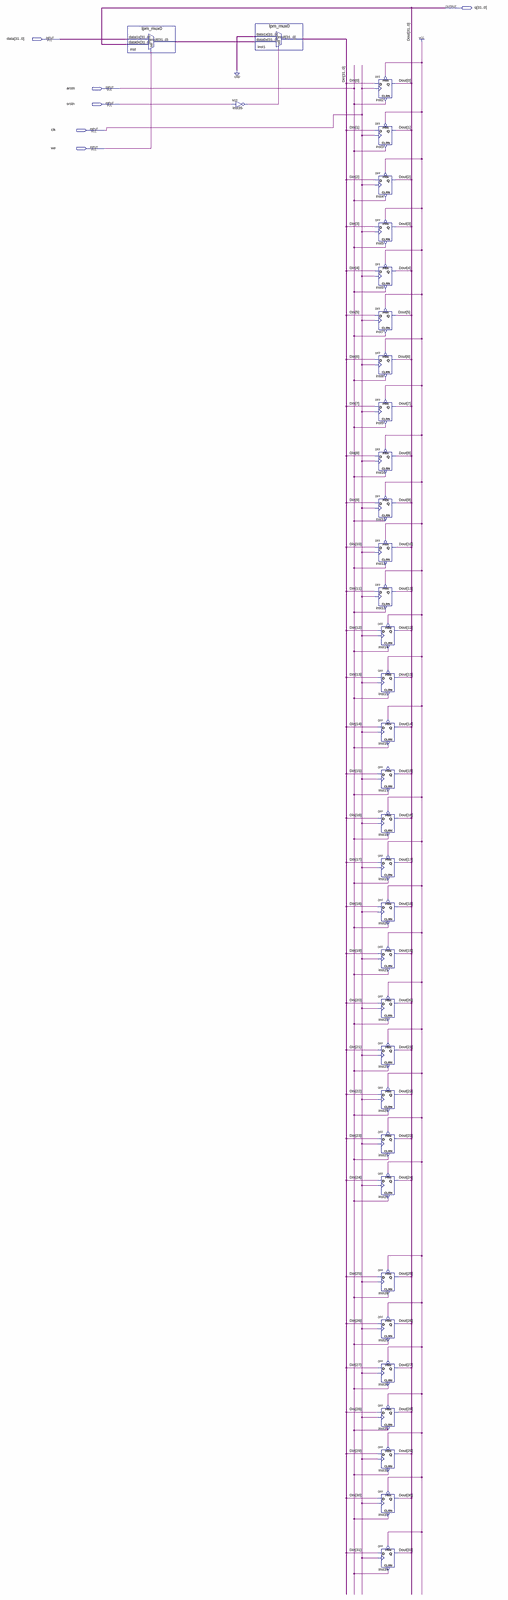
[diagram p0: schematic sheet, whole]
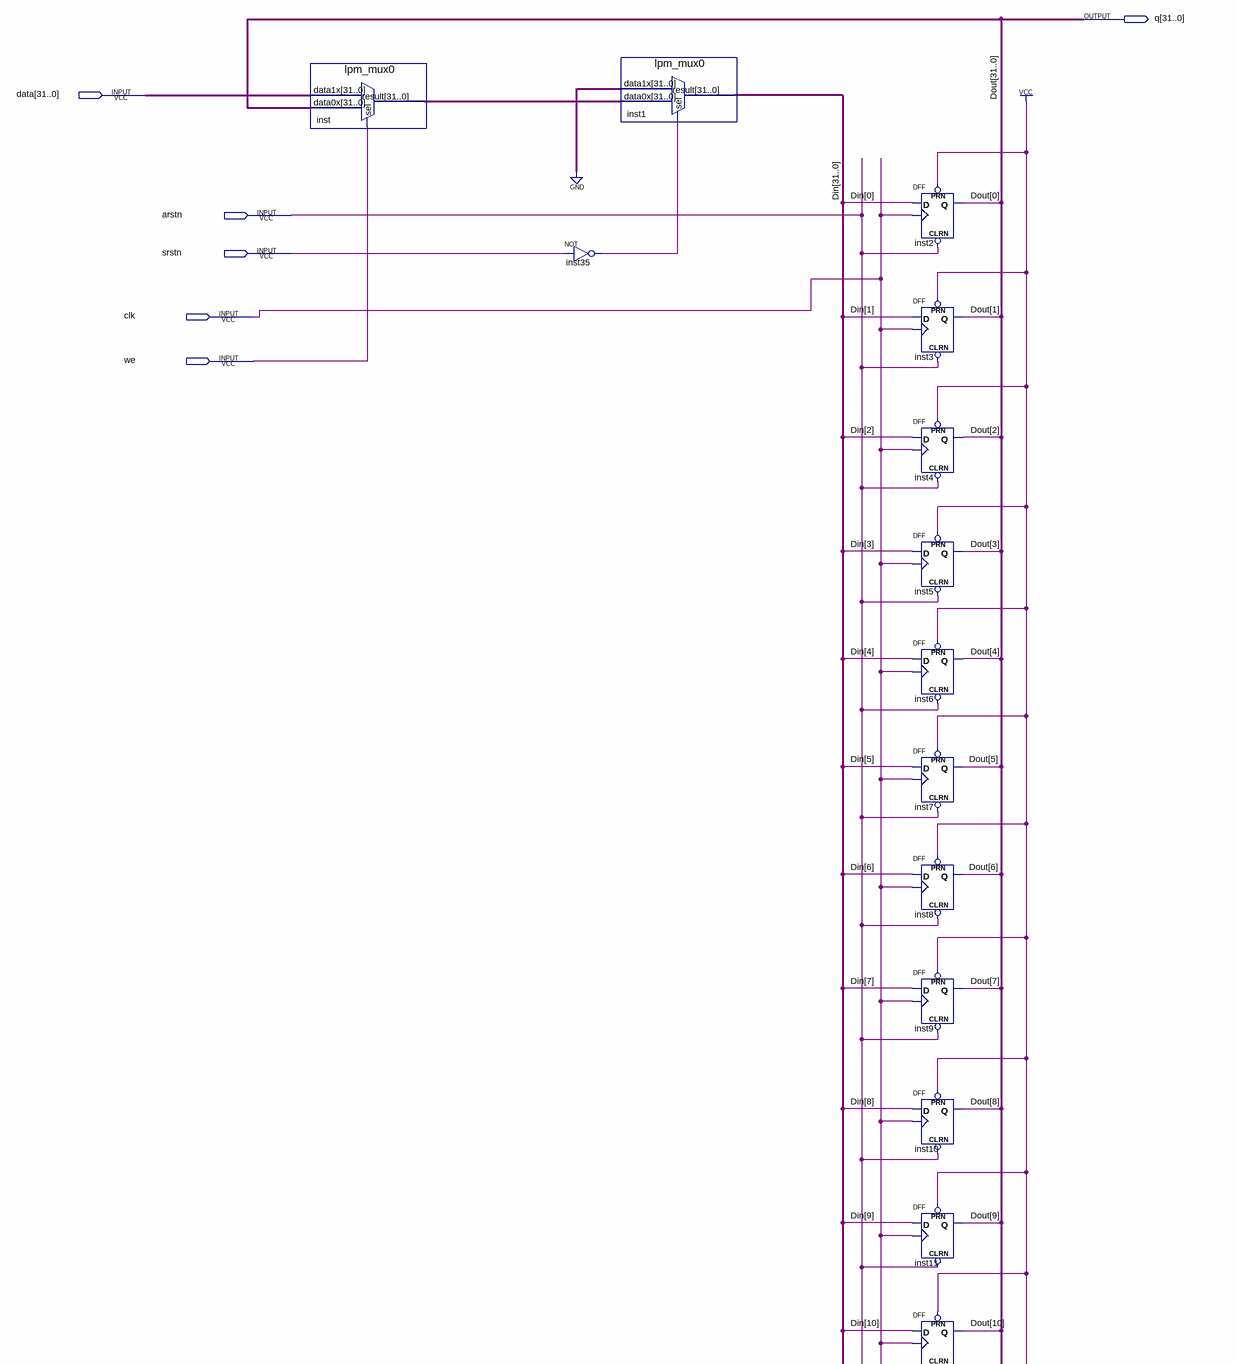
[diagram p1: schematic sheet, upper part]
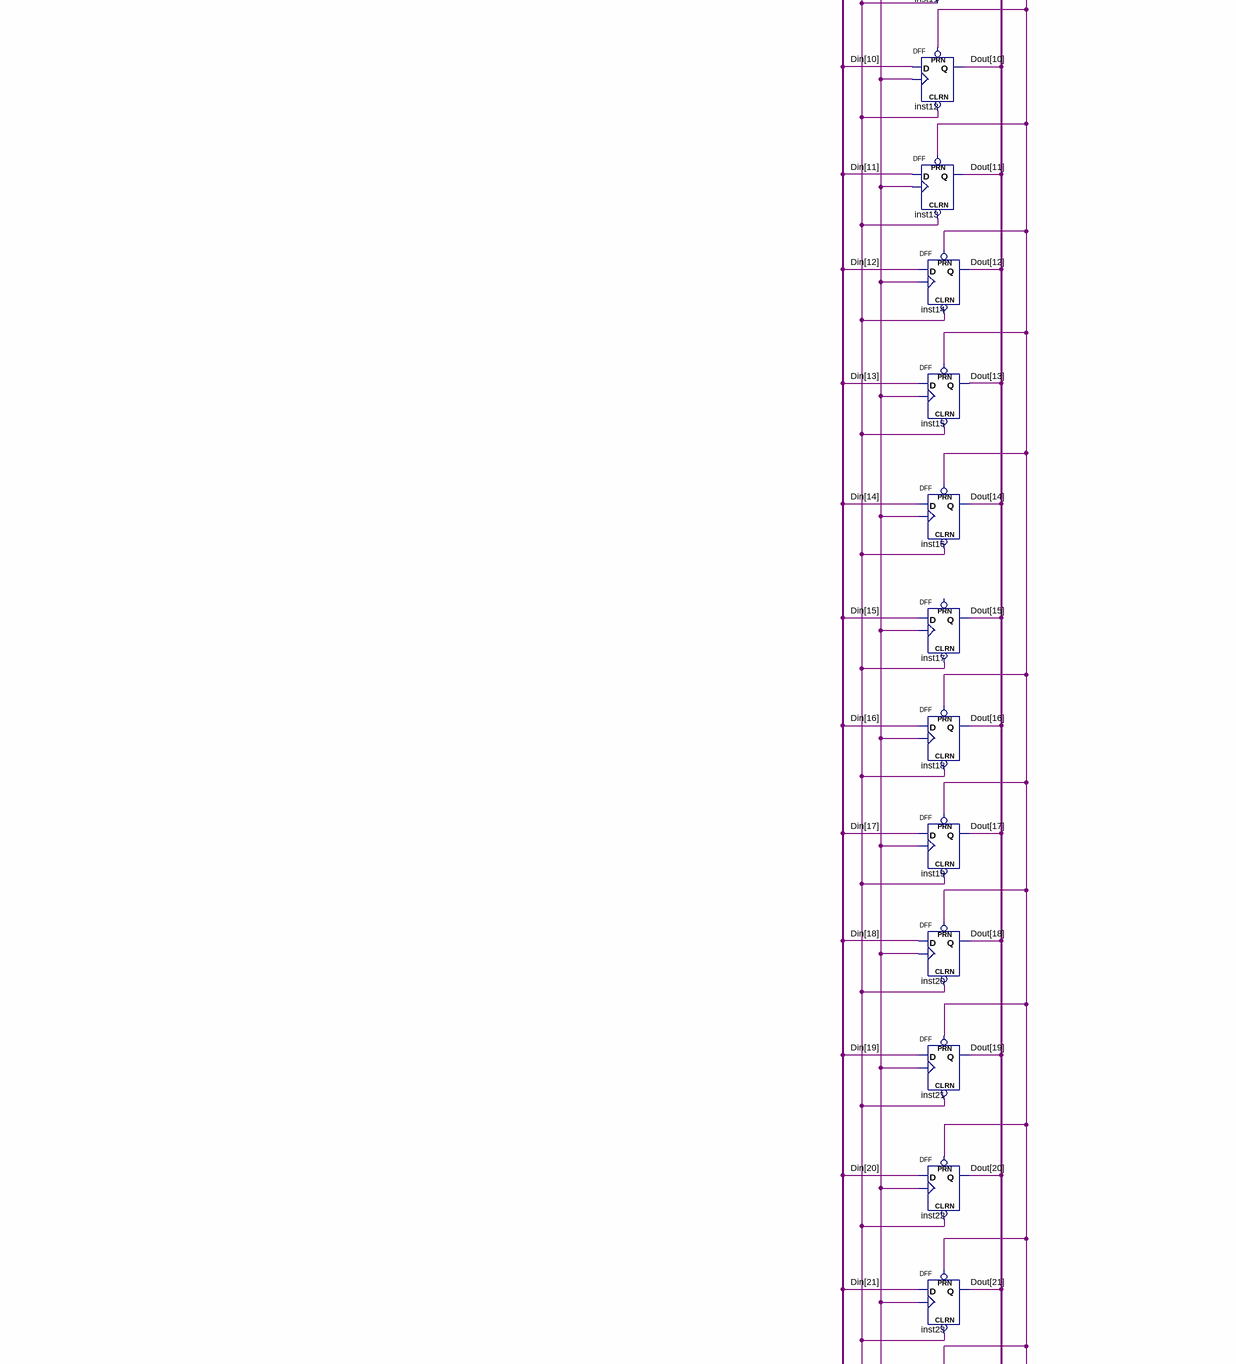
[diagram p2: schematic sheet, middle part]
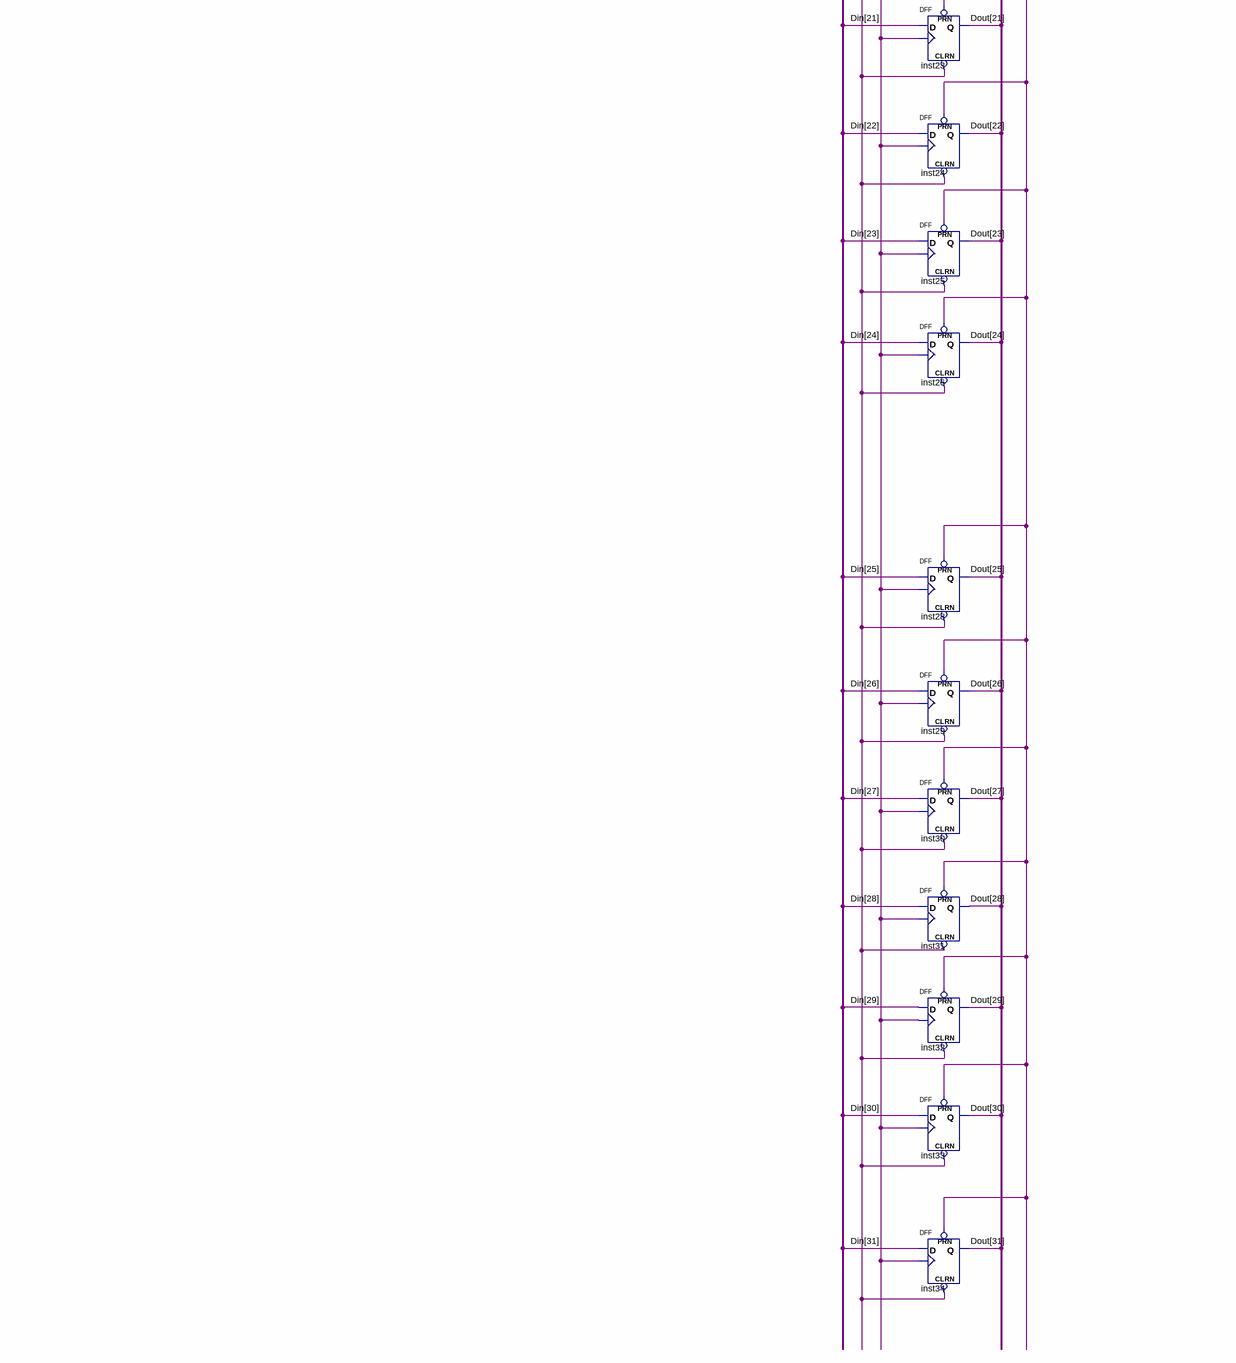
[diagram p3: schematic sheet, lower part]
// Quartus schematic lab1.bdf as structural Verilog: 35 symbols, 6 pins
module lab1 (
  input  [31:0] data,
  input  arstn,
  input  srstn,
  input  clk,
  input  we,
  output [31:0] q
);

  wire inst35_out;
  wire [31:0] Din, inst_result;

  lpm_mux0 inst (.data1x(data), .data0x(q), .sel(we), .result(inst_result));
  not inst35 (inst35_out, srstn);
  lpm_mux0 inst1 (.data1x({32{1'b0}}), .data0x(inst_result), .sel(inst35_out), .result(Din));
  DFF inst2 (.CLRN(arstn), .CLK(clk), .D(Din[0]), .PRN(1'b1), .Q(q[0]));
  DFF inst3 (.CLRN(arstn), .CLK(clk), .D(Din[1]), .PRN(1'b1), .Q(q[1]));
  DFF inst4 (.CLRN(arstn), .CLK(clk), .D(Din[2]), .PRN(1'b1), .Q(q[2]));
  DFF inst5 (.CLRN(arstn), .CLK(clk), .D(Din[3]), .PRN(1'b1), .Q(q[3]));
  DFF inst6 (.CLRN(arstn), .CLK(clk), .D(Din[4]), .PRN(1'b1), .Q(q[4]));
  DFF inst7 (.CLRN(arstn), .CLK(clk), .D(Din[5]), .PRN(1'b1), .Q(q[5]));
  DFF inst8 (.CLRN(arstn), .CLK(clk), .D(Din[6]), .PRN(1'b1), .Q(q[6]));
  DFF inst9 (.CLRN(arstn), .CLK(clk), .D(Din[7]), .PRN(1'b1), .Q(q[7]));
  DFF inst10 (.CLRN(arstn), .CLK(clk), .D(Din[8]), .PRN(1'b1), .Q(q[8]));
  DFF inst11 (.CLRN(arstn), .CLK(clk), .D(Din[9]), .PRN(1'b1), .Q(q[9]));
  DFF inst12 (.CLRN(arstn), .CLK(clk), .D(Din[10]), .PRN(1'b1), .Q(q[10]));
  DFF inst13 (.CLRN(arstn), .CLK(clk), .D(Din[11]), .PRN(1'b1), .Q(q[11]));
  DFF inst14 (.CLRN(arstn), .CLK(clk), .D(Din[12]), .PRN(1'b1), .Q(q[12]));
  DFF inst15 (.CLRN(arstn), .CLK(clk), .D(Din[13]), .PRN(1'b1), .Q(q[13]));
  DFF inst16 (.CLRN(arstn), .CLK(clk), .D(Din[14]), .PRN(1'b1), .Q(q[14]));
  DFF inst17 (.CLRN(arstn), .CLK(clk), .D(Din[15]), .Q(q[15]));  // open: PRN
  DFF inst18 (.CLRN(arstn), .CLK(clk), .D(Din[16]), .PRN(1'b1), .Q(q[16]));
  DFF inst19 (.CLRN(arstn), .CLK(clk), .D(Din[17]), .PRN(1'b1), .Q(q[17]));
  DFF inst20 (.CLRN(arstn), .CLK(clk), .D(Din[18]), .PRN(1'b1), .Q(q[18]));
  DFF inst21 (.CLRN(arstn), .CLK(clk), .D(Din[19]), .PRN(1'b1), .Q(q[19]));
  DFF inst22 (.CLRN(arstn), .CLK(clk), .D(Din[20]), .PRN(1'b1), .Q(q[20]));
  DFF inst23 (.CLRN(arstn), .CLK(clk), .D(Din[21]), .PRN(1'b1), .Q(q[21]));
  DFF inst24 (.CLRN(arstn), .CLK(clk), .D(Din[22]), .PRN(1'b1), .Q(q[22]));
  DFF inst25 (.CLRN(arstn), .CLK(clk), .D(Din[23]), .PRN(1'b1), .Q(q[23]));
  DFF inst26 (.CLRN(arstn), .CLK(clk), .D(Din[24]), .PRN(1'b1), .Q(q[24]));
  DFF inst28 (.CLRN(arstn), .CLK(clk), .D(Din[25]), .PRN(1'b1), .Q(q[25]));
  DFF inst29 (.CLRN(arstn), .CLK(clk), .D(Din[26]), .PRN(1'b1), .Q(q[26]));
  DFF inst30 (.CLRN(arstn), .CLK(clk), .D(Din[27]), .PRN(1'b1), .Q(q[27]));
  DFF inst31 (.CLRN(arstn), .CLK(clk), .D(Din[28]), .PRN(1'b1), .Q(q[28]));
  DFF inst32 (.CLRN(arstn), .CLK(clk), .D(Din[29]), .PRN(1'b1), .Q(q[29]));
  DFF inst33 (.CLRN(arstn), .CLK(clk), .D(Din[30]), .PRN(1'b1), .Q(q[30]));
  DFF inst34 (.CLRN(arstn), .CLK(clk), .D(Din[31]), .PRN(1'b1), .Q(q[31]));

  // Other names for the same wires on the sheet: Dout[31:0] = q
endmodule
